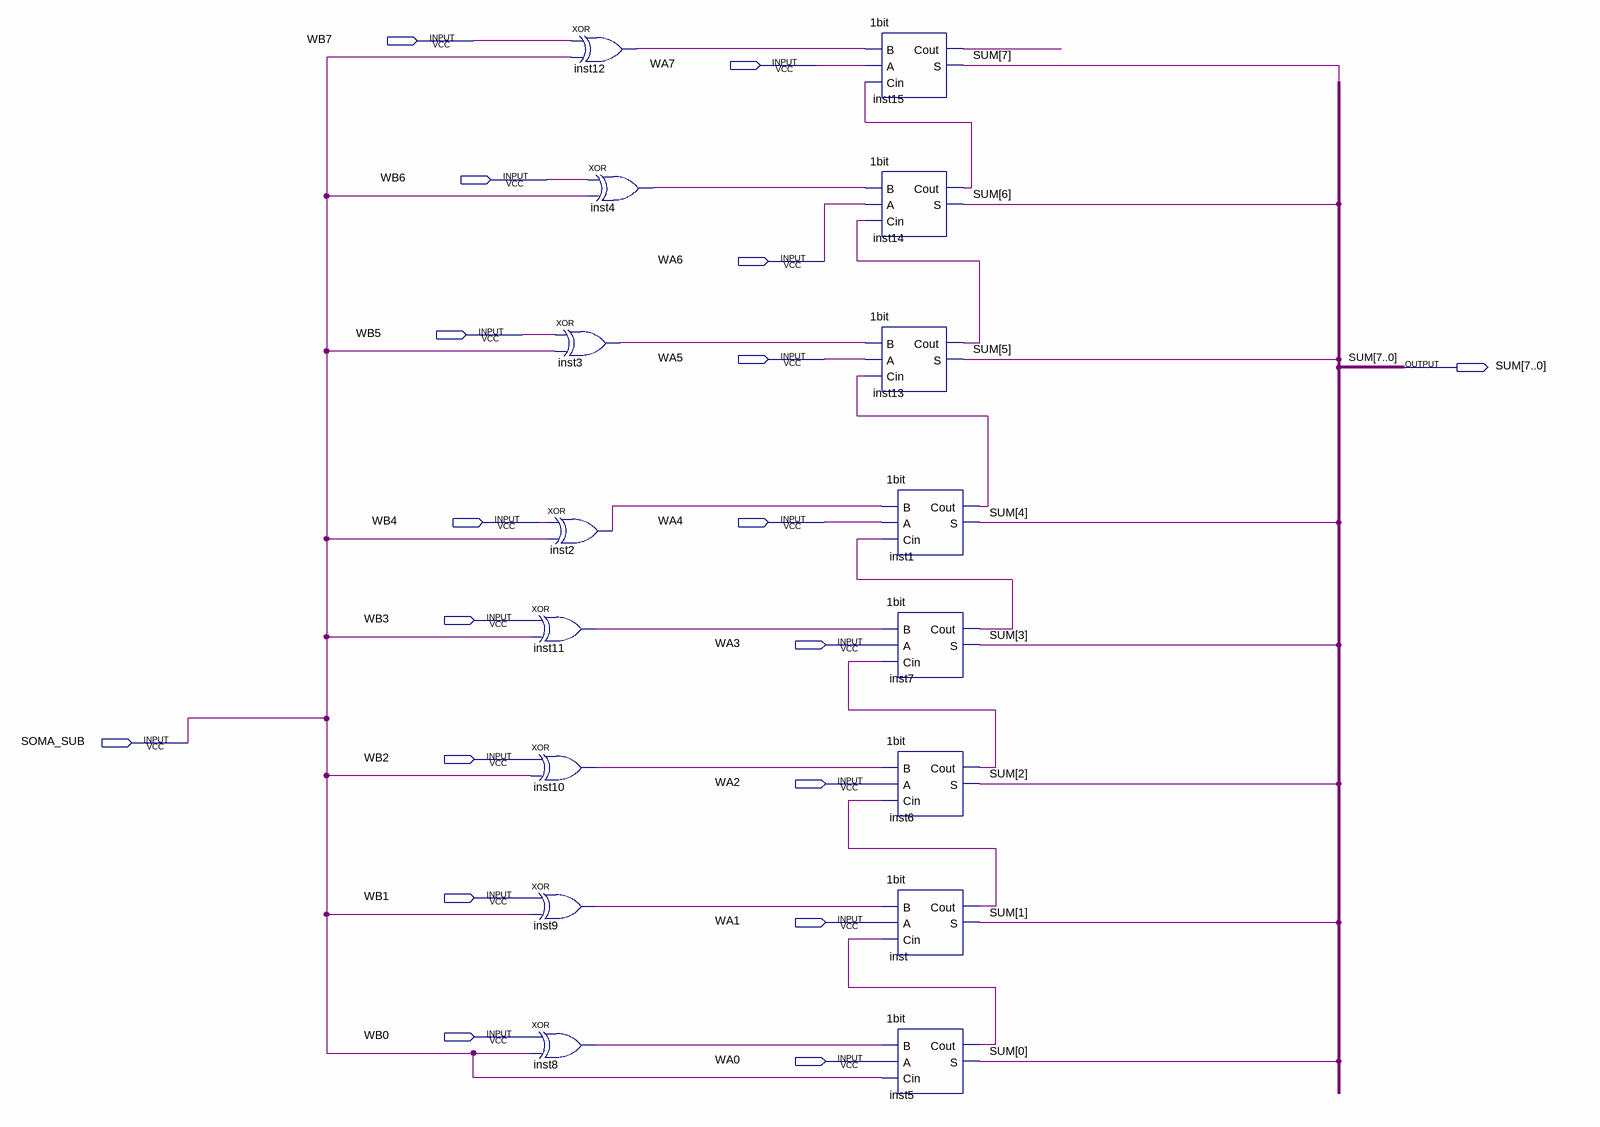
[diagram p0: schematic sheet]
// Quartus schematic soma8bit.bdf as structural Verilog: 16 symbols, 18 pins
module soma8bit (
  input  WB7,
  input  WA7,
  input  WB6,
  input  WA6,
  input  WB5,
  input  WA5,
  input  WB4,
  input  WA4,
  input  WB3,
  input  WA3,
  input  SOMA_SUB,
  input  WB2,
  input  WA2,
  input  WB1,
  input  WA1,
  input  WB0,
  input  WA0,
  output [7:0] SUM
);

  wire inst1_cout, inst2_out, inst3_out, inst4_out, inst5_cout, inst6_cout, inst7_cout, inst8_out, inst9_out,
       inst10_out, inst11_out, inst12_out, inst13_cout, inst14_cout, inst15_cout, inst_cout;

  xor inst11 (inst11_out, WB3, SOMA_SUB);
  xor inst10 (inst10_out, WB2, SOMA_SUB);
  xor inst9 (inst9_out, WB1, SOMA_SUB);
  xor inst8 (inst8_out, WB0, SOMA_SUB);
  xor inst12 (inst12_out, WB7, SOMA_SUB);
  xor inst4 (inst4_out, WB6, SOMA_SUB);
  xor inst3 (inst3_out, WB5, SOMA_SUB);
  xor inst2 (inst2_out, WB4, SOMA_SUB);
  \1bit  inst15 (.B(inst12_out), .A(WA7), .Cin(inst14_cout), .Cout(inst15_cout), .S(SUM[7]));
  \1bit  inst14 (.B(inst4_out), .A(WA6), .Cin(inst13_cout), .Cout(inst14_cout), .S(SUM[6]));
  \1bit  inst13 (.B(inst3_out), .A(WA5), .Cin(inst1_cout), .Cout(inst13_cout), .S(SUM[5]));
  \1bit  inst1 (.B(inst2_out), .A(WA4), .Cin(inst7_cout), .Cout(inst1_cout), .S(SUM[4]));
  \1bit  inst7 (.B(inst11_out), .A(WA3), .Cin(inst6_cout), .Cout(inst7_cout), .S(SUM[3]));
  \1bit  inst6 (.B(inst10_out), .A(WA2), .Cin(inst_cout), .Cout(inst6_cout), .S(SUM[2]));
  \1bit  inst (.B(inst9_out), .A(WA1), .Cin(inst5_cout), .Cout(inst_cout), .S(SUM[1]));
  \1bit  inst5 (.B(inst8_out), .A(WA0), .Cin(SOMA_SUB), .Cout(inst5_cout), .S(SUM[0]));
endmodule
